# Altium project CB_REV_D.PrjPcb
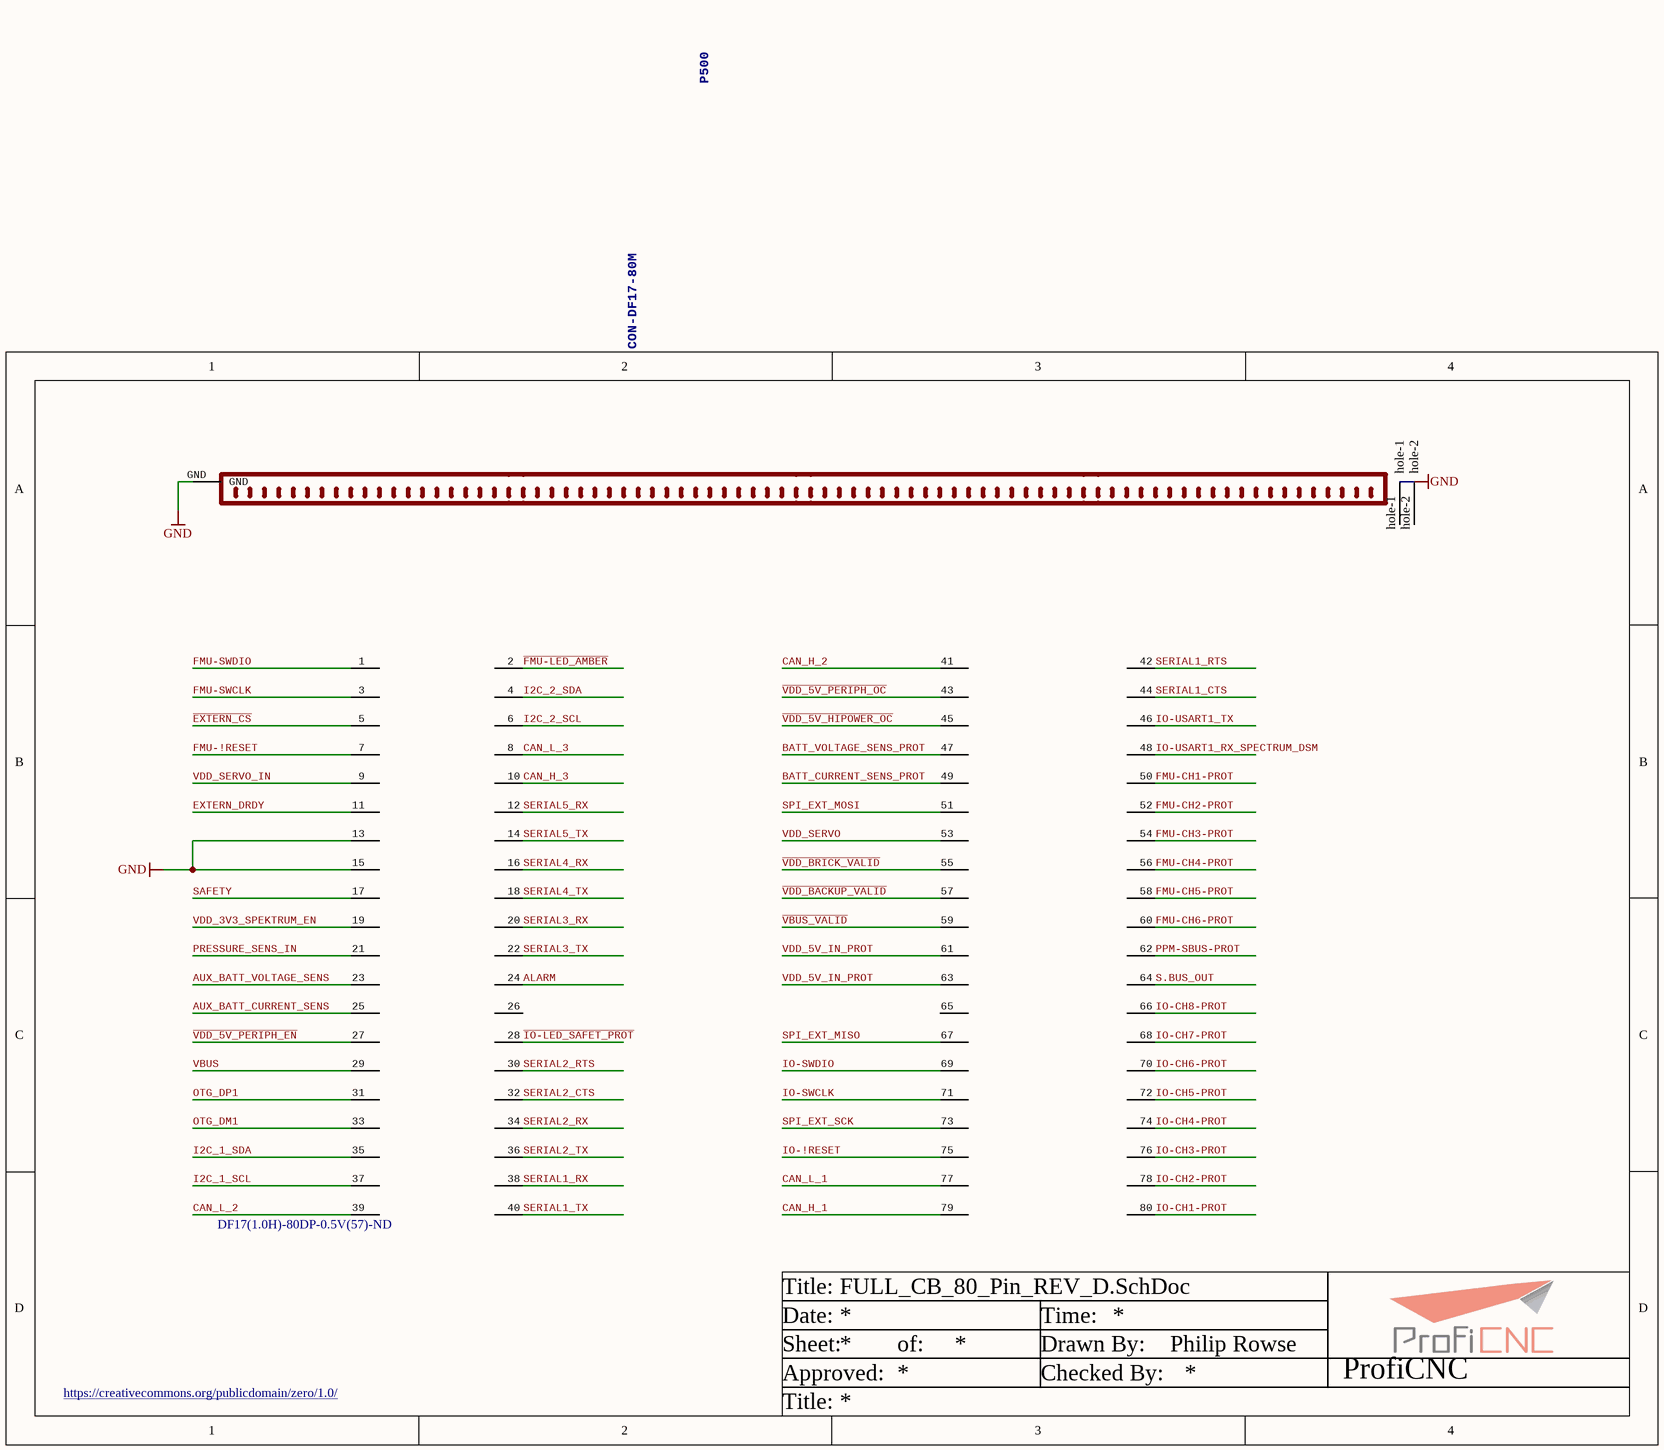
[diagram p0: FULL_CB_80_Pin_REV_D.SchDoc]
5 sheets, 34 parts. Net scope: global (net labels, ports and power ports of the same name join across sheets).
Board file: FULL_CB_REV_D.PcbDoc
Sheets:
  FULL_CB_80_Pin_REV_D.SchDoc
  FULL_CB_Plugs_REV_D.SchDoc
  FULL_CB_Power_REV_D.SchDoc
  FULL_CB_Servo_REV_D.SchDoc
  FULL_CB_tp_REV_D.SchDoc

## Sheet FULL_CB_80_Pin_REV_D.SchDoc
size A4; DrawnBy: Philip Rowse

### Parts
P500  CON-DF17-80M  Supplier Part Number 1: DF17(1.0H)-80DP-0.5V(57)-ND

### Nets
GND: P500.13 P500.15 P500.GND
ALARM: P500.24
AUX_BATT_CURRENT_SENS: P500.25
AUX_BATT_VOLTAGE_SENS: P500.23
BATT_CURRENT_SENS_PROT: P500.49
BATT_VOLTAGE_SENS_PROT: P500.47
CAN_H_1: P500.79
CAN_H_2: P500.41
CAN_H_3: P500.10
CAN_L_1: P500.77
CAN_L_2: P500.39
CAN_L_3: P500.8
~{EXTERN_CS}: P500.5
EXTERN_DRDY: P500.11
~{FMU-LED_AMBER}: P500.2
FMU-!RESET: P500.7
FMU-CH1-PROT: P500.50
FMU-CH2-PROT: P500.52
FMU-CH3-PROT: P500.54
FMU-CH4-PROT: P500.56
FMU-CH5-PROT: P500.58
FMU-CH6-PROT: P500.60
FMU-SWCLK: P500.3
FMU-SWDIO: P500.1
I2C_1_SCL: P500.37
I2C_1_SDA: P500.35
I2C_2_SCL: P500.6
I2C_2_SDA: P500.4
~{IO-LED_SAFET_PROT}: P500.28
IO-!RESET: P500.75
IO-CH1-PROT: P500.80
IO-CH2-PROT: P500.78
IO-CH3-PROT: P500.76
IO-CH4-PROT: P500.74
IO-CH5-PROT: P500.72
IO-CH6-PROT: P500.70
IO-CH7-PROT: P500.68
IO-CH8-PROT: P500.66
IO-SWCLK: P500.71
IO-SWDIO: P500.69
IO-USART1_RX_SPECTRUM_DSM: P500.48
IO-USART1_TX: P500.46
OTG_DM1: P500.33
OTG_DP1: P500.31
PPM-SBUS-PROT: P500.62
PRESSURE_SENS_IN: P500.21
S.BUS_OUT: P500.64
SAFETY: P500.17
SERIAL1_CTS: P500.44
SERIAL1_RTS: P500.42
SERIAL1_RX: P500.38
SERIAL1_TX: P500.40
SERIAL2_CTS: P500.32
SERIAL2_RTS: P500.30
SERIAL2_RX: P500.34
SERIAL2_TX: P500.36
SERIAL3_RX: P500.20
SERIAL3_TX: P500.22
SERIAL4_RX: P500.16
SERIAL4_TX: P500.18
SERIAL5_RX: P500.12
SERIAL5_TX: P500.14
SPI_EXT_MISO: P500.67
SPI_EXT_MOSI: P500.51
SPI_EXT_SCK: P500.73
~{VBUS_VALID}: P500.59
~{VDD_5V_HIPOWER_OC}: P500.45
~{VDD_5V_PERIPH_EN}: P500.27
~{VDD_5V_PERIPH_OC}: P500.43
~{VDD_BACKUP_VALID}: P500.57
~{VDD_BRICK_VALID}: P500.55
VBUS: P500.29
VDD_3V3_SPEKTRUM_EN: P500.19
VDD_5V_IN_PROT: P500.61 P500.63
VDD_SERVO: P500.53
VDD_SERVO_IN: P500.9

Not connected (* = marked no-connect by the designer): P500 26 65 hole-1 hole-2

### Notes on the sheet
- Title:
- Date:
- Time:
- https://creativecommons.org/publicdomain/zero/1.0/
- Sheet:
- Approved:
- of:
- Drawn By:
- Checked By:
- ProfiCNC

### Library data of the parts
P500 = CON-DF17-80M: Connector, Header, 80Pos, .5MM, DUAL, SMD, Au; Supplier 1: Digi-Key

## Sheet FULL_CB_Plugs_REV_D.SchDoc
size A4; DrawnBy: Philip Rowse
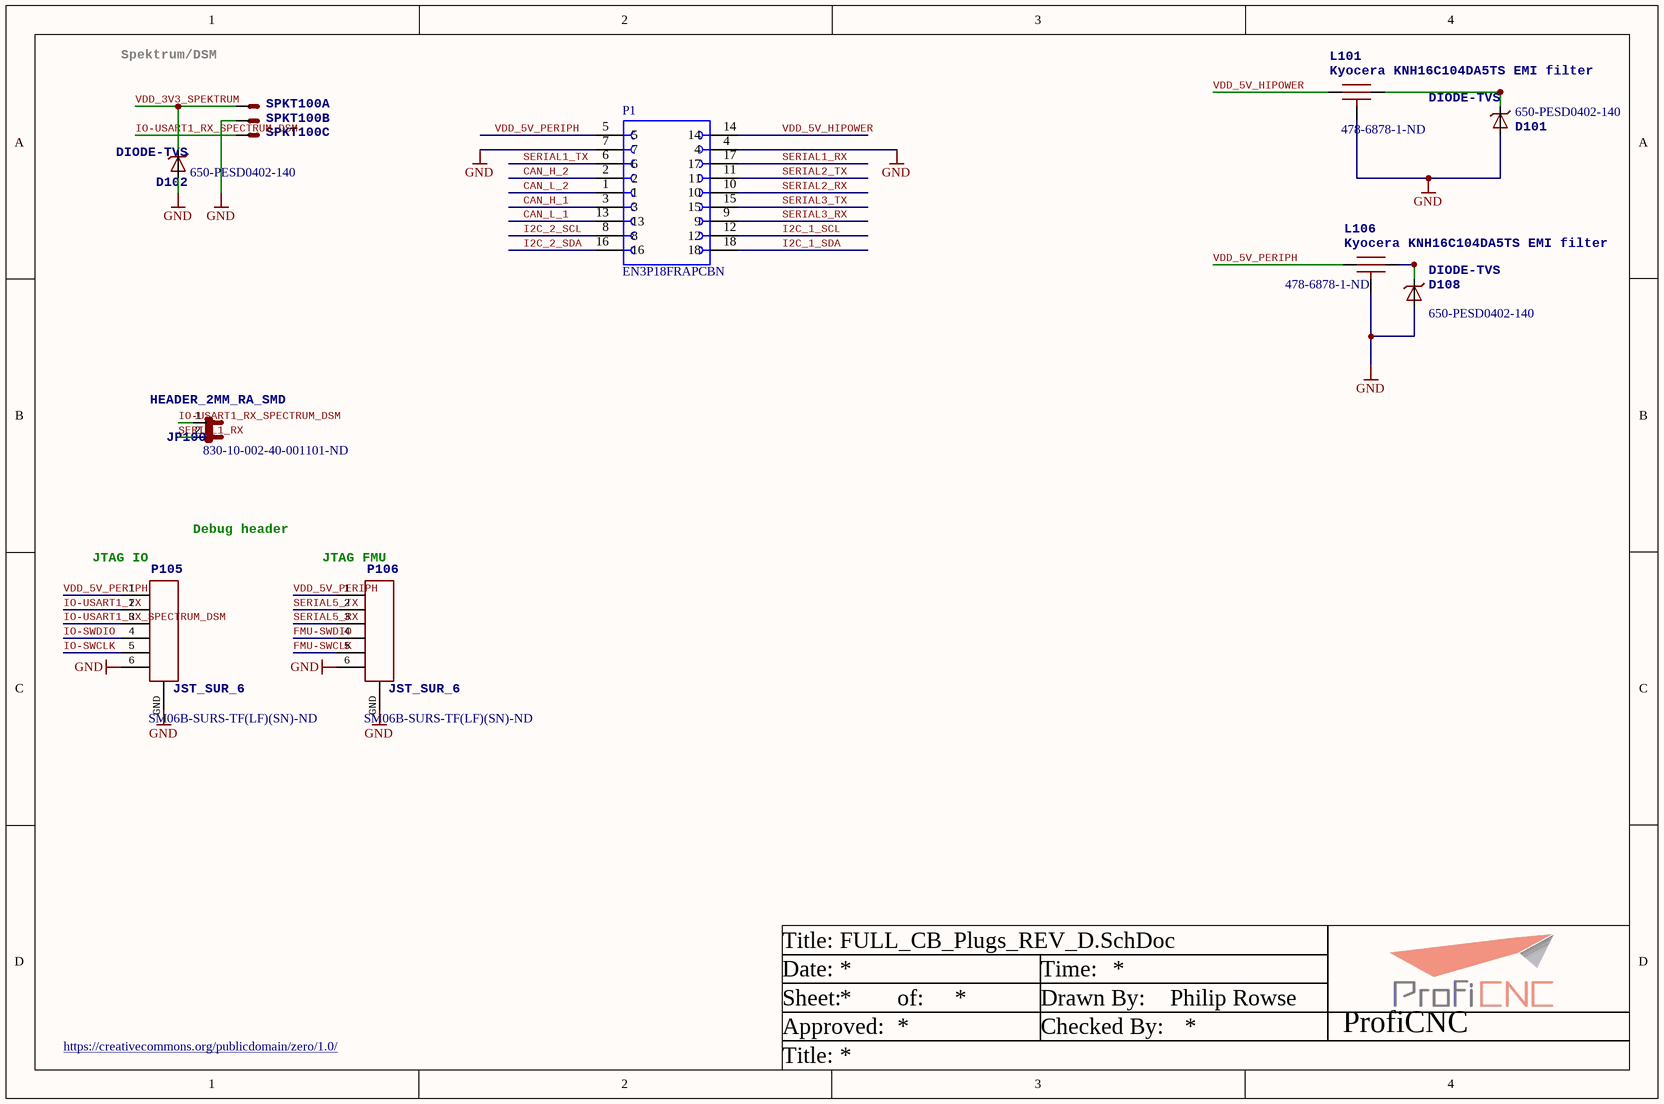
[diagram p1: FULL_CB_Plugs_REV_D.SchDoc]

### Parts
D101  DIODE-TVS  Supplier Part Number 1: 650-PESD0402-140  [0402-TVS]
D102  DIODE-TVS  Supplier Part Number 1: 650-PESD0402-140  [0402-TVS]
D108  DIODE-TVS  Supplier Part Number 1: 650-PESD0402-140  [0402-TVS]
JP100  HEADER_2MM_RA_SMD  Supplier Part Number 1: 830-10-002-40-001101-ND  [HEADER_2MM_RA_2]
L101  Kyocera KNH16C104DA5TS EMI filter  Supplier Part Number 1: 478-6878-1-ND  [KYOCERA-KNH16-DA]
L106  Kyocera KNH16C104DA5TS EMI filter  Supplier Part Number 1: 478-6878-1-ND  [KYOCERA-KNH16-DA]
P1  EN3P18FRAPCBN  [SWITCHCRAFT_EN3P18FRAPCBN]
P105  JST_SUR_6  Supplier Part Number 1: SM06B-SURS-TF(LF)(SN)-ND  [JST_SUR_H6]
P106  JST_SUR_6  Supplier Part Number 1: SM06B-SURS-TF(LF)(SN)-ND  [JST_SUR_H6]
SPKT100  CONN_SPEKTRUM_RX-TH  [B3B-ZR]  (value not drawn)  (parts A,B,C of 3)

### Nets
GND: D101.A D102.A D108.A L101.GND L106.GND P1.4 P1.7 P105.6 P105.GND P106.6 P106.GND SPKT100.2(S)
CAN_H_1: P1.3
CAN_H_2: P1.2
CAN_L_1: P1.13
CAN_L_2: P1.1
FMU-SWCLK: P106.5
FMU-SWDIO: P106.4
I2C_1_SCL: P1.12
I2C_1_SDA: P1.18
I2C_2_SCL: P1.8
I2C_2_SDA: P1.16
IO-SWCLK: P105.5
IO-SWDIO: P105.4
IO-USART1_RX_SPECTRUM_DSM: JP100.1 P105.3 SPKT100.1(S)
IO-USART1_TX: P105.2
SERIAL1_RX: JP100.2 P1.17
SERIAL1_TX: P1.6
SERIAL2_RX: P1.10
SERIAL2_TX: P1.11
SERIAL3_RX: P1.9
SERIAL3_TX: P1.15
SERIAL5_RX: P106.3
SERIAL5_TX: P106.2
VDD_3V3_SPEKTRUM: D102.C SPKT100.3(S)
VDD_5V_HIPOWER: L101.P$1 P1.14
VDD_5V_PERIPH: L106.P$1 P1.5 P105.1 P106.1
NetD101_C: D101.C L101.P$2
NetD108_C: D108.C L106.P$2

### Notes on the sheet
- Spektrum/DSM
- Debug header
- (near P105) JTAG IO
- (near P106) JTAG FMU
- Title:
- Date:
- Time:
- https://creativecommons.org/publicdomain/zero/1.0/
- Sheet:
- Approved:
- of:
- Drawn By:
- Checked By:
- ProfiCNC

### Library data of the parts
D101 D102 D108 = DIODE-TVS: Diode, TVS, 14VWM, 40VC, 0402, SMD; Supplier 1: Mouser
JP100 = HEADER_2MM_RA_SMD: Connector, PCB, 2MM, 2Pos, R/A, SMD, Au; Supplier 1: Digi-Key
L101 L106 = KNH16C104DA5TS: Capacitor, Filter, 0.1uF, 25V, 2A, 0603, SMD; Supplier 1: Digi-Key
P105 P106 = JST_SUR_6: Connector, Header, 6Pos, .8mm IDC, R/A, SMD, Tin; Supplier 1: Digi-Key
SPKT100 = CONN_SPEKTRUM_RX-TH: Spektrum RX connector; JST ZH series S3B-ZR-SM4A-TF; PARTNO: B3B-ZR(LF)(SN)
P1 = EN3P18FRAPCBN: Package: None; Price: None; Value: *; MP: EN3P18FRAPCBN; Availability: Unavailable

## Sheet FULL_CB_Power_REV_D.SchDoc
size A4; DrawnBy: Philip Rowse
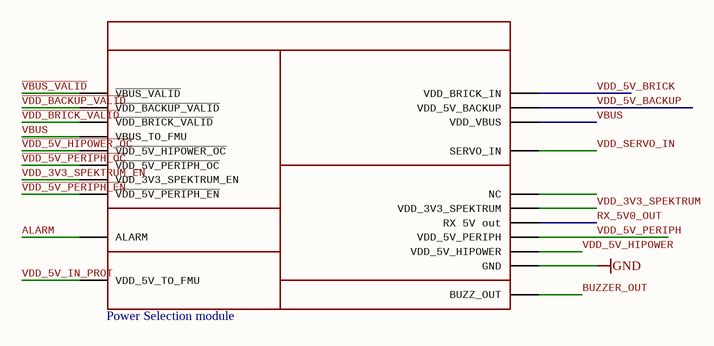
[diagram p2: FULL_CB_Power_REV_D.SchDoc]

### Parts
PSM200  Power Selection module  [PSM]

### Nets
GND: PSM200.GND
ALARM: PSM200.ALARM
BUZZER_OUT: PSM200.BUZZER_OUT(BUZZ_OUT)
RX_5V0_OUT: PSM200.RX(RX_5V_out)
~{VBUS_VALID}: PSM200.!VBUS_VALID(~{VBUS_VALID})
~{VDD_5V_HIPOWER_OC}: PSM200.!VDD_5V_HIPOWER_OC(~{VDD_5V_HIPOWER_OC})
~{VDD_5V_PERIPH_EN}: PSM200.!VDD_5V_PERIPH_EN(~{VDD_5V_PERIPH_EN})
~{VDD_5V_PERIPH_OC}: PSM200.!VDD_5V_PERIPH_OC(~{VDD_5V_PERIPH_OC})
~{VDD_BACKUP_VALID}: PSM200.!VDD_BACKUP_VALID(~{VDD_BACKUP_VALID})
~{VDD_BRICK_VALID}: PSM200.!VDD_BRICK_VALID(~{VDD_BRICK_VALID})
VBUS: PSM200.VBUS(VBUS_TO_FMU) PSM200.VDD_VBUS
VDD_3V3_SPEKTRUM: PSM200.SPEK(VDD_3V3_SPEKTRUM)
VDD_3V3_SPEKTRUM_EN: PSM200.VDD_3V3_SPEKTRUM_EN
VDD_5V_BACKUP: PSM200.VDD_5V_BACKUP
VDD_5V_BRICK: PSM200.VDD_BRICK_IN
VDD_5V_HIPOWER: PSM200.5V_HIPOWER(VDD_5V_HIPOWER)
VDD_5V_IN_PROT: PSM200.VDD_5V_IN_PROT(VDD_5V_TO_FMU)
VDD_5V_PERIPH: PSM200.5V_PERIPH(VDD_5V_PERIPH)
VDD_SERVO_IN: PSM200.SERVO_IN

Not connected (* = marked no-connect by the designer): PSM200 NC

### Notes on the sheet
- Title:
- Date:
- Time:
- https://creativecommons.org/publicdomain/zero/1.0/
- Sheet:
- Approved:
- of:
- Drawn By:
- Checked By:
- ProfiCNC

### Library data of the parts
PSM200 = PSMPSM: PCA, PSM, Assembly

## Sheet FULL_CB_Servo_REV_D.SchDoc
size A4; DrawnBy: Philip Rowse
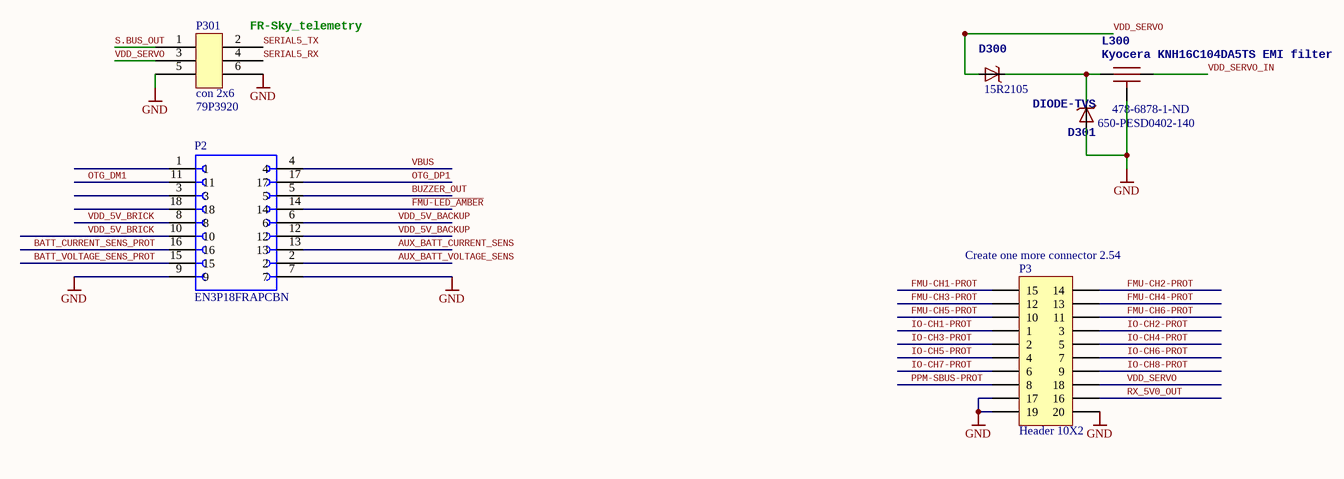
[diagram p3: FULL_CB_Servo_REV_D.SchDoc]

### Parts
D300  Supplier Part Number 1: 15R2105  [MICROSMP]  (hidden comment: MSS1P4-M3)
D301  DIODE-TVS  Supplier Part Number 1: 650-PESD0402-140  [0402-TVS]
L300  Kyocera KNH16C104DA5TS EMI filter  Supplier Part Number 1: 478-6878-1-ND  [KYOCERA-KNH16-DA]
P2  EN3P18FRAPCBN  [SWITCHCRAFT_EN3P18FRAPCBN]
P3  Header 10X2  [HDR2X10]
P301  con 2x6  Supplier Part Number 1: 79P3920  [TSW-103-07-G-D]

### Nets
GND: D301.A L300.GND P2.7 P2.9 P3.17 P3.19 P3.20 P301.5 P301.6
AUX_BATT_CURRENT_SENS: P2.13
AUX_BATT_VOLTAGE_SENS: P2.2
BATT_CURRENT_SENS_PROT: P2.16
BATT_VOLTAGE_SENS_PROT: P2.15
BUZZER_OUT: P2.5
~{FMU-LED_AMBER}: P2.14
FMU-CH1-PROT: P3.15
FMU-CH2-PROT: P3.14
FMU-CH3-PROT: P3.12
FMU-CH4-PROT: P3.13
FMU-CH5-PROT: P3.10
FMU-CH6-PROT: P3.11
IO-CH1-PROT: P3.1
IO-CH2-PROT: P3.3
IO-CH3-PROT: P3.2
IO-CH4-PROT: P3.5
IO-CH5-PROT: P3.4
IO-CH6-PROT: P3.7
IO-CH7-PROT: P3.6
IO-CH8-PROT: P3.9
OTG_DM1: P2.11
OTG_DP1: P2.17
PPM-SBUS-PROT: P3.8
RX_5V0_OUT: P3.16
S.BUS_OUT: P301.1
SERIAL5_RX: P301.4
SERIAL5_TX: P301.2
VBUS: P2.4
VDD_5V_BACKUP: P2.6 P2.12
VDD_5V_BRICK: P2.8 P2.10
VDD_SERVO: D300.ANODE(A) P3.18 P301.3
VDD_SERVO_IN: L300.P$2
NetD300_CATHODE: D300.CATHODE(C) D301.C L300.P$1

Not connected (* = marked no-connect by the designer): P2 1 3 18

### Notes on the sheet
- (near P301) FR-Sky_telemetry
- (near P3) Create one more connector 2.54
- Title
- Size:
- Date:
- A4
- Number:
- Time:
- Revision:
- Sheet
- of
- File:

### Library data of the parts
D300 = DIODE-SCHOTTKY_MSMP: Diode, Schottky, 40V, 1A, MicroSMP, SMD; Supplier 1: Newark
D301 = DIODE-TVS: Diode, TVS, 14VWM, 40VC, 0402, SMD; Supplier 1: Mouser
L300 = KNH16C104DA5TS: as L101 on sheet FULL_CB_Plugs_REV_D; Supplier 1: Digi-Key
P3 = Header 10X2: Header, 10-Pin, Dual row; LatestRevisionDate: 17-Jul-2002; LatestRevisionNote: Re-released for DXP Platform.; Publisher: Altium Limited
P301 = con 2x6: Connector, Header, 6Pos, 2.54MM, Vert, THT, Au; Supplier 1: Newark
P2 = EN3P18FRAPCBN: Package: None; Price: None; Value: *; MP: EN3P18FRAPCBN; Availability: Unavailable

## Sheet FULL_CB_tp_REV_D.SchDoc
size A4; DrawnBy: Philip Rowse
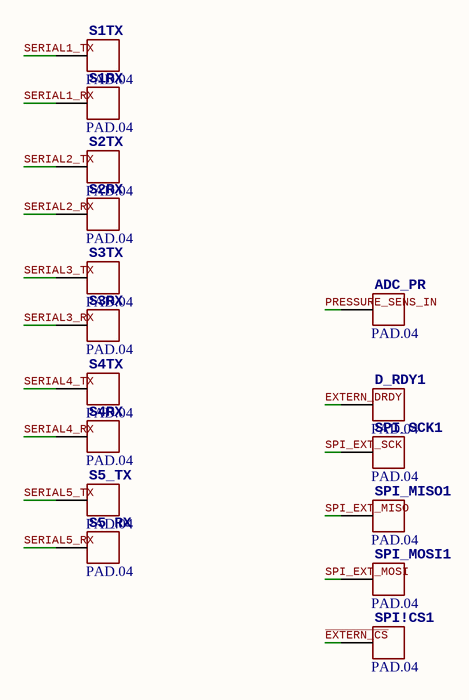
[diagram p4: FULL_CB_tp_REV_D.SchDoc]

### Parts
ADC_PR  PAD.04  [PAD.04X.04]
D_RDY1  PAD.04  [PAD.04X.04]
S1RX  PAD.04  [PAD.04X.04]
S1TX  PAD.04  [PAD.04X.04]
S2RX  PAD.04  [PAD.04X.04]
S2TX  PAD.04  [PAD.04X.04]
S3RX  PAD.04  [PAD.04X.04]
S3TX  PAD.04  [PAD.04X.04]
S4RX  PAD.04  [PAD.04X.04]
S4TX  PAD.04  [PAD.04X.04]
S5_RX  PAD.04  [PAD.04X.04]
S5_TX  PAD.04  [PAD.04X.04]
SPI!CS1  PAD.04  [PAD.04X.04]
SPI_MISO1  PAD.04  [PAD.04X.04]
SPI_MOSI1  PAD.04  [PAD.04X.04]
SPI_SCK1  PAD.04  [PAD.04X.04]

### Nets
~{EXTERN_CS}: SPI!CS1.P$1
EXTERN_DRDY: D_RDY1.P$1
PRESSURE_SENS_IN: ADC_PR.P$1
SERIAL1_RX: S1RX.P$1
SERIAL1_TX: S1TX.P$1
SERIAL2_RX: S2RX.P$1
SERIAL2_TX: S2TX.P$1
SERIAL3_RX: S3RX.P$1
SERIAL3_TX: S3TX.P$1
SERIAL4_RX: S4RX.P$1
SERIAL4_TX: S4TX.P$1
SERIAL5_RX: S5_RX.P$1
SERIAL5_TX: S5_TX.P$1
SPI_EXT_MISO: SPI_MISO1.P$1
SPI_EXT_MOSI: SPI_MOSI1.P$1
SPI_EXT_SCK: SPI_SCK1.P$1

### Notes on the sheet
- Title:
- Date:
- Time:
- https://creativecommons.org/publicdomain/zero/1.0/
- Sheet:
- Approved:
- of:
- Drawn By:
- Checked By:
- ProfiCNC

## Nets that join several sheets
GND: FULL_CB_80_Pin_REV_D (P500.13 P500.15 P500.GND), FULL_CB_Plugs_REV_D (12 pins), FULL_CB_Power_REV_D (PSM200.GND), FULL_CB_Servo_REV_D (9 pins)
ALARM: FULL_CB_80_Pin_REV_D (P500.24), FULL_CB_Power_REV_D (PSM200.ALARM)
AUX_BATT_CURRENT_SENS: FULL_CB_80_Pin_REV_D (P500.25), FULL_CB_Servo_REV_D (P2.13)
AUX_BATT_VOLTAGE_SENS: FULL_CB_80_Pin_REV_D (P500.23), FULL_CB_Servo_REV_D (P2.2)
BATT_CURRENT_SENS_PROT: FULL_CB_80_Pin_REV_D (P500.49), FULL_CB_Servo_REV_D (P2.16)
BATT_VOLTAGE_SENS_PROT: FULL_CB_80_Pin_REV_D (P500.47), FULL_CB_Servo_REV_D (P2.15)
BUZZER_OUT: FULL_CB_Power_REV_D (PSM200.BUZZER_OUT), FULL_CB_Servo_REV_D (P2.5)
CAN_H_1: FULL_CB_80_Pin_REV_D (P500.79), FULL_CB_Plugs_REV_D (P1.3)
CAN_H_2: FULL_CB_80_Pin_REV_D (P500.41), FULL_CB_Plugs_REV_D (P1.2)
CAN_L_1: FULL_CB_80_Pin_REV_D (P500.77), FULL_CB_Plugs_REV_D (P1.13)
CAN_L_2: FULL_CB_80_Pin_REV_D (P500.39), FULL_CB_Plugs_REV_D (P1.1)
~{EXTERN_CS}: FULL_CB_80_Pin_REV_D (P500.5), FULL_CB_tp_REV_D (SPI!CS1.P$1)
EXTERN_DRDY: FULL_CB_80_Pin_REV_D (P500.11), FULL_CB_tp_REV_D (D_RDY1.P$1)
~{FMU-LED_AMBER}: FULL_CB_80_Pin_REV_D (P500.2), FULL_CB_Servo_REV_D (P2.14)
FMU-CH1-PROT: FULL_CB_80_Pin_REV_D (P500.50), FULL_CB_Servo_REV_D (P3.15)
FMU-CH2-PROT: FULL_CB_80_Pin_REV_D (P500.52), FULL_CB_Servo_REV_D (P3.14)
FMU-CH3-PROT: FULL_CB_80_Pin_REV_D (P500.54), FULL_CB_Servo_REV_D (P3.12)
FMU-CH4-PROT: FULL_CB_80_Pin_REV_D (P500.56), FULL_CB_Servo_REV_D (P3.13)
FMU-CH5-PROT: FULL_CB_80_Pin_REV_D (P500.58), FULL_CB_Servo_REV_D (P3.10)
FMU-CH6-PROT: FULL_CB_80_Pin_REV_D (P500.60), FULL_CB_Servo_REV_D (P3.11)
FMU-SWCLK: FULL_CB_80_Pin_REV_D (P500.3), FULL_CB_Plugs_REV_D (P106.5)
FMU-SWDIO: FULL_CB_80_Pin_REV_D (P500.1), FULL_CB_Plugs_REV_D (P106.4)
I2C_1_SCL: FULL_CB_80_Pin_REV_D (P500.37), FULL_CB_Plugs_REV_D (P1.12)
I2C_1_SDA: FULL_CB_80_Pin_REV_D (P500.35), FULL_CB_Plugs_REV_D (P1.18)
I2C_2_SCL: FULL_CB_80_Pin_REV_D (P500.6), FULL_CB_Plugs_REV_D (P1.8)
I2C_2_SDA: FULL_CB_80_Pin_REV_D (P500.4), FULL_CB_Plugs_REV_D (P1.16)
IO-CH1-PROT: FULL_CB_80_Pin_REV_D (P500.80), FULL_CB_Servo_REV_D (P3.1)
IO-CH2-PROT: FULL_CB_80_Pin_REV_D (P500.78), FULL_CB_Servo_REV_D (P3.3)
IO-CH3-PROT: FULL_CB_80_Pin_REV_D (P500.76), FULL_CB_Servo_REV_D (P3.2)
IO-CH4-PROT: FULL_CB_80_Pin_REV_D (P500.74), FULL_CB_Servo_REV_D (P3.5)
IO-CH5-PROT: FULL_CB_80_Pin_REV_D (P500.72), FULL_CB_Servo_REV_D (P3.4)
IO-CH6-PROT: FULL_CB_80_Pin_REV_D (P500.70), FULL_CB_Servo_REV_D (P3.7)
IO-CH7-PROT: FULL_CB_80_Pin_REV_D (P500.68), FULL_CB_Servo_REV_D (P3.6)
IO-CH8-PROT: FULL_CB_80_Pin_REV_D (P500.66), FULL_CB_Servo_REV_D (P3.9)
IO-SWCLK: FULL_CB_80_Pin_REV_D (P500.71), FULL_CB_Plugs_REV_D (P105.5)
IO-SWDIO: FULL_CB_80_Pin_REV_D (P500.69), FULL_CB_Plugs_REV_D (P105.4)
IO-USART1_RX_SPECTRUM_DSM: FULL_CB_80_Pin_REV_D (P500.48), FULL_CB_Plugs_REV_D (JP100.1 P105.3 SPKT100.1)
IO-USART1_TX: FULL_CB_80_Pin_REV_D (P500.46), FULL_CB_Plugs_REV_D (P105.2)
OTG_DM1: FULL_CB_80_Pin_REV_D (P500.33), FULL_CB_Servo_REV_D (P2.11)
OTG_DP1: FULL_CB_80_Pin_REV_D (P500.31), FULL_CB_Servo_REV_D (P2.17)
PPM-SBUS-PROT: FULL_CB_80_Pin_REV_D (P500.62), FULL_CB_Servo_REV_D (P3.8)
PRESSURE_SENS_IN: FULL_CB_80_Pin_REV_D (P500.21), FULL_CB_tp_REV_D (ADC_PR.P$1)
RX_5V0_OUT: FULL_CB_Power_REV_D (PSM200.RX), FULL_CB_Servo_REV_D (P3.16)
S.BUS_OUT: FULL_CB_80_Pin_REV_D (P500.64), FULL_CB_Servo_REV_D (P301.1)
SERIAL1_RX: FULL_CB_80_Pin_REV_D (P500.38), FULL_CB_Plugs_REV_D (JP100.2 P1.17), FULL_CB_tp_REV_D (S1RX.P$1)
SERIAL1_TX: FULL_CB_80_Pin_REV_D (P500.40), FULL_CB_Plugs_REV_D (P1.6), FULL_CB_tp_REV_D (S1TX.P$1)
SERIAL2_RX: FULL_CB_80_Pin_REV_D (P500.34), FULL_CB_Plugs_REV_D (P1.10), FULL_CB_tp_REV_D (S2RX.P$1)
SERIAL2_TX: FULL_CB_80_Pin_REV_D (P500.36), FULL_CB_Plugs_REV_D (P1.11), FULL_CB_tp_REV_D (S2TX.P$1)
SERIAL3_RX: FULL_CB_80_Pin_REV_D (P500.20), FULL_CB_Plugs_REV_D (P1.9), FULL_CB_tp_REV_D (S3RX.P$1)
SERIAL3_TX: FULL_CB_80_Pin_REV_D (P500.22), FULL_CB_Plugs_REV_D (P1.15), FULL_CB_tp_REV_D (S3TX.P$1)
SERIAL4_RX: FULL_CB_80_Pin_REV_D (P500.16), FULL_CB_tp_REV_D (S4RX.P$1)
SERIAL4_TX: FULL_CB_80_Pin_REV_D (P500.18), FULL_CB_tp_REV_D (S4TX.P$1)
SERIAL5_RX: FULL_CB_80_Pin_REV_D (P500.12), FULL_CB_Plugs_REV_D (P106.3), FULL_CB_Servo_REV_D (P301.4), FULL_CB_tp_REV_D (S5_RX.P$1)
SERIAL5_TX: FULL_CB_80_Pin_REV_D (P500.14), FULL_CB_Plugs_REV_D (P106.2), FULL_CB_Servo_REV_D (P301.2), FULL_CB_tp_REV_D (S5_TX.P$1)
SPI_EXT_MISO: FULL_CB_80_Pin_REV_D (P500.67), FULL_CB_tp_REV_D (SPI_MISO1.P$1)
SPI_EXT_MOSI: FULL_CB_80_Pin_REV_D (P500.51), FULL_CB_tp_REV_D (SPI_MOSI1.P$1)
SPI_EXT_SCK: FULL_CB_80_Pin_REV_D (P500.73), FULL_CB_tp_REV_D (SPI_SCK1.P$1)
~{VBUS_VALID}: FULL_CB_80_Pin_REV_D (P500.59), FULL_CB_Power_REV_D (PSM200.!VBUS_VALID)
~{VDD_5V_HIPOWER_OC}: FULL_CB_80_Pin_REV_D (P500.45), FULL_CB_Power_REV_D (PSM200.!VDD_5V_HIPOWER_OC)
~{VDD_5V_PERIPH_EN}: FULL_CB_80_Pin_REV_D (P500.27), FULL_CB_Power_REV_D (PSM200.!VDD_5V_PERIPH_EN)
~{VDD_5V_PERIPH_OC}: FULL_CB_80_Pin_REV_D (P500.43), FULL_CB_Power_REV_D (PSM200.!VDD_5V_PERIPH_OC)
~{VDD_BACKUP_VALID}: FULL_CB_80_Pin_REV_D (P500.57), FULL_CB_Power_REV_D (PSM200.!VDD_BACKUP_VALID)
~{VDD_BRICK_VALID}: FULL_CB_80_Pin_REV_D (P500.55), FULL_CB_Power_REV_D (PSM200.!VDD_BRICK_VALID)
VBUS: FULL_CB_80_Pin_REV_D (P500.29), FULL_CB_Power_REV_D (PSM200.VBUS PSM200.VDD_VBUS), FULL_CB_Servo_REV_D (P2.4)
VDD_3V3_SPEKTRUM: FULL_CB_Plugs_REV_D (D102.C SPKT100.3), FULL_CB_Power_REV_D (PSM200.SPEK)
VDD_3V3_SPEKTRUM_EN: FULL_CB_80_Pin_REV_D (P500.19), FULL_CB_Power_REV_D (PSM200.VDD_3V3_SPEKTRUM_EN)
VDD_5V_BACKUP: FULL_CB_Power_REV_D (PSM200.VDD_5V_BACKUP), FULL_CB_Servo_REV_D (P2.6 P2.12)
VDD_5V_BRICK: FULL_CB_Power_REV_D (PSM200.VDD_BRICK_IN), FULL_CB_Servo_REV_D (P2.8 P2.10)
VDD_5V_HIPOWER: FULL_CB_Plugs_REV_D (L101.P$1 P1.14), FULL_CB_Power_REV_D (PSM200.5V_HIPOWER)
VDD_5V_IN_PROT: FULL_CB_80_Pin_REV_D (P500.61 P500.63), FULL_CB_Power_REV_D (PSM200.VDD_5V_IN_PROT)
VDD_5V_PERIPH: FULL_CB_Plugs_REV_D (L106.P$1 P1.5 P105.1 P106.1), FULL_CB_Power_REV_D (PSM200.5V_PERIPH)
VDD_SERVO: FULL_CB_80_Pin_REV_D (P500.53), FULL_CB_Servo_REV_D (D300.ANODE P3.18 P301.3)
VDD_SERVO_IN: FULL_CB_80_Pin_REV_D (P500.9), FULL_CB_Power_REV_D (PSM200.SERVO_IN), FULL_CB_Servo_REV_D (L300.P$2)